# Altium schematic sheet MKRZero_V5.0_1.SchDoc: MKRZero_V5.0
size 409 x 289 mm; Origin: Eagle; Date: 2023-03-06 22:57:54; SheetNumber: 2; CODE-ARDUINO: DNP; DATASHEET: DNP; DISTRIBUTOR-LINK: DNP; DISTRIBUTOR-PN: DNP; MANUFACTURER: DNP; MANUFACTURER-PN: DNP; NOTE: DNP; Value: DNP; GateName_1: G$1; SymbolName_1: A3L-LOC; LibraryName: Arduino-utility; DeviceSetName: A3-FRAME; Sheet: Sheet:; ReferenceDesignsAREPROVIDED"ASIS"AND"WITHALLFAULTS.ArduinoSADISCLAIMSALLOTHERWARRANTIES,EXPRESSORIMPLIED,
REGARDINGPRODUCTS,INCLUDINGBUTNOTLIMITEDTO,ANYIMPLIEDWARRANTIESOFMERCHANTABILITYORFITNESSFORAPARTICULARPURPOSE

ArduinoSAmaymakechangestospecificationsandproductdescriptionsatanytime,withoutnotice.TheCustomermustnot
relyontheabsenceorcharacteristicsofanyfeaturesorinstructionsmarked"reserved"or"undefined."ArduinoSAreserves
theseforfuturedefinitionandshallhavenoresponsibilitywhatsoeverforconflictsorincompatibilitiesarisingfromfuturechangestothem.
TheproductinformationontheWebSiteorMaterialsissubjecttochangewithoutnotice.Donotfinalizeadesignwiththisinfo

ARDUINOandotherArduinobrandsandlogosandTrademarksofArduinoSA.AllArduinoSATrademarkscannotbeusedwithoutowner'sformalpermission: Reference Designs ARE PROVIDED "AS IS" AND "WITH ALL FAULTS. Arduino SA DISCLAIMS ALL OTHER WARRANTIES, EXPRESS OR IMPLIED, / REGARDING PRODUCTS, INCLUDING BUT NOT LIMITED TO, ANY IMPLIED WARRANTIES OF MERCHANTABILITY OR FITNESS FOR A PARTICULAR PURPOSE / Arduino SA may make changes to specifications and product descriptions at any time, without notice. The Customer must not / rely on the absence or characteristics of any features or instructions marked "reserved" or "undefined." Arduino SA reserves / these for future definition and shall have no responsibility whatsoever for conflicts or incompatibilities arising from future changes to them. / The product information on the Web Site or Materials is subject to change without notice. Do not finalize a design with this info / ARDUINO and other Arduino brands and logos and Trademarks of Arduino SA. All Arduino SA Trademarks cannot be used without owner's formal permission
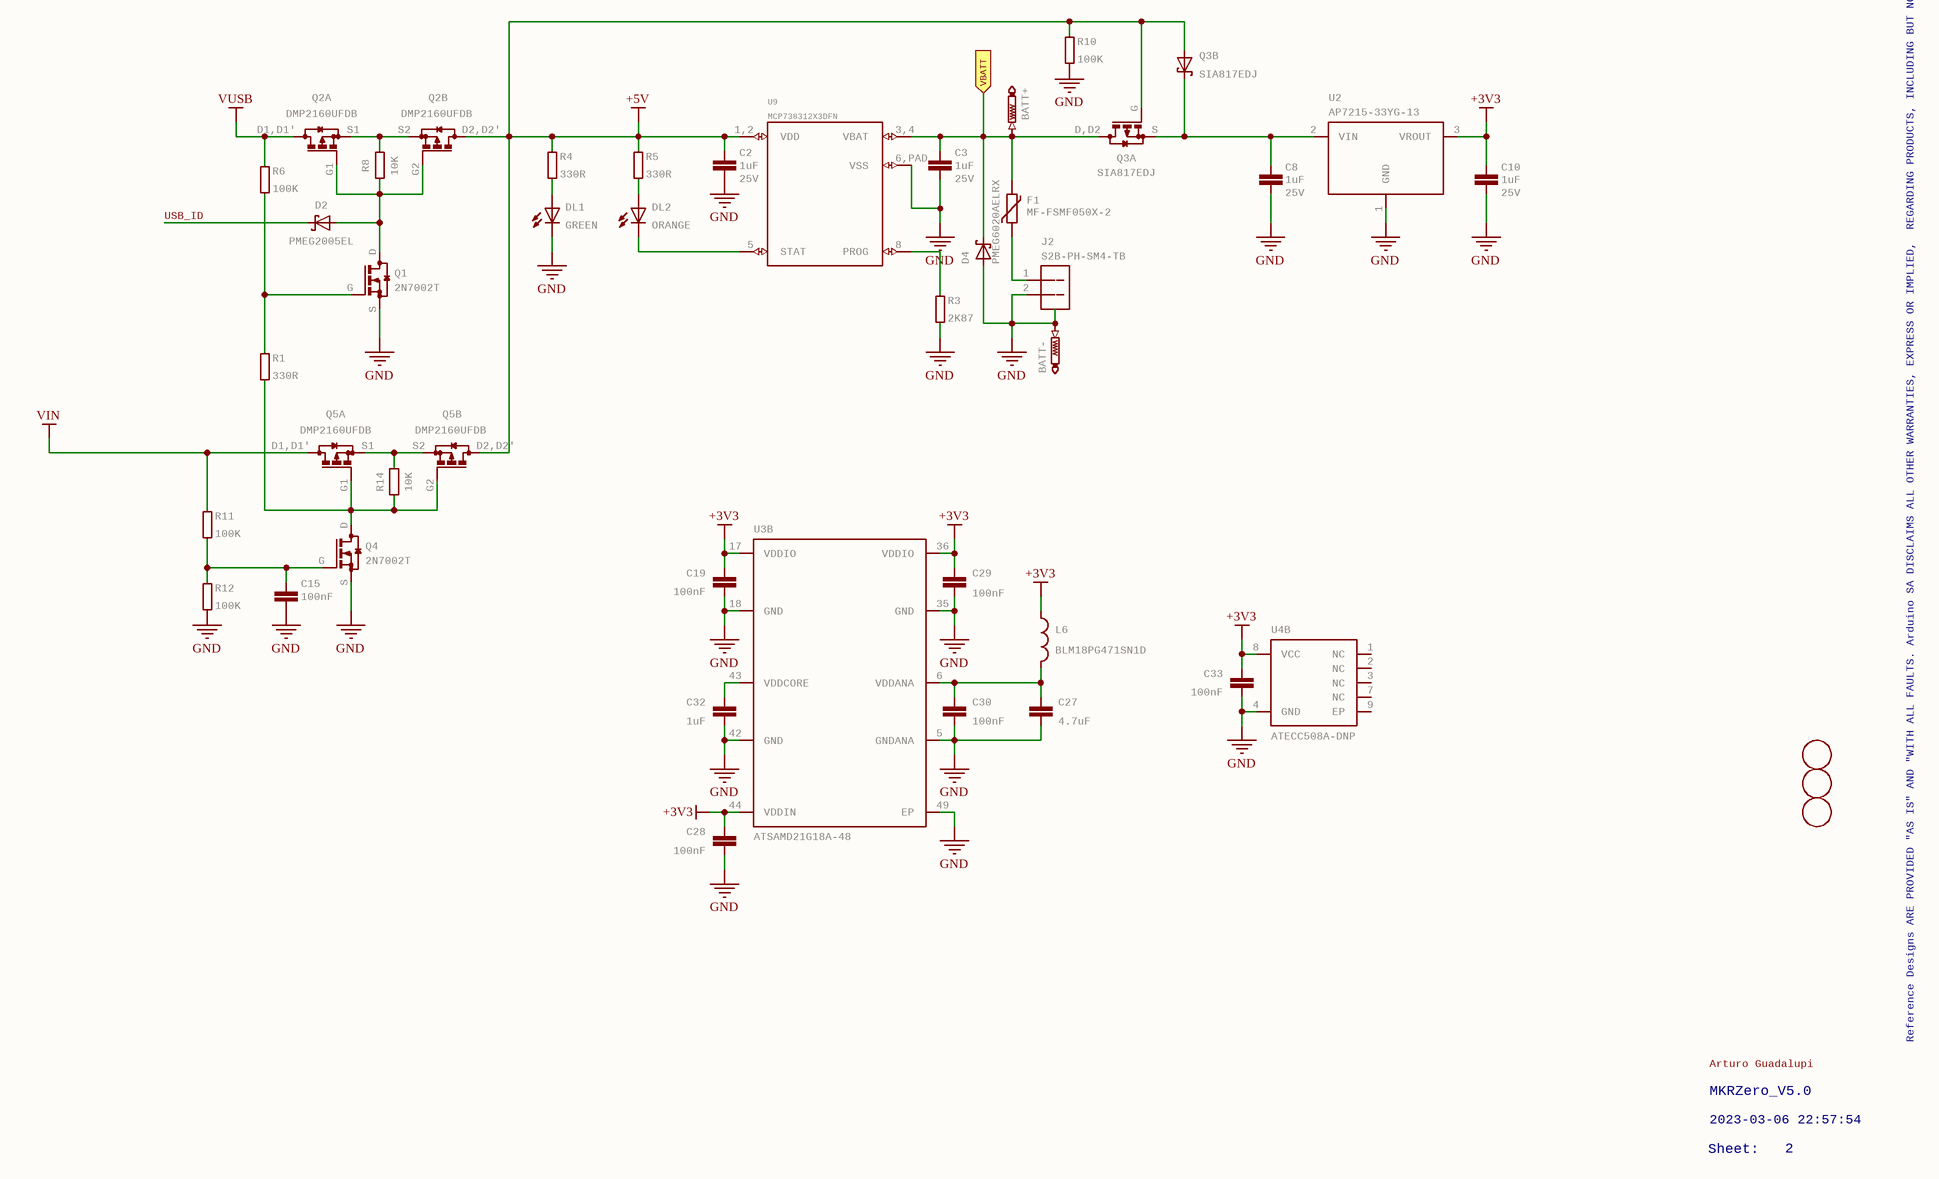
[diagram p0: MKRZero_V5.0_1.SchDoc]

## Parts
BATT+  PTR1B1,27  [B1,27]  (value not drawn)
BATT-  PTR1B1,27  [B1,27]  (value not drawn)
C2  1uF  VOLTAGE: 25V  [0402-1005X55N]
C3  1uF  VOLTAGE: 25V  [0402-1005X55N]
C8  1uF  VOLTAGE: 25V  [0402-1005X55N]
C10  1uF  VOLTAGE: 25V  [0402-1005X55N]
C15  100nF  [0402-1005X55N]
C19  100nF  [0402-1005X55N]
C27  4.7uF  [0402-1005X55N]
C28  100nF  [0402-1005X55N]
C29  100nF  [0402-1005X55N]
C30  100nF  [0402-1005X55N]
C32  1uF  [0402-1005X55N]
C33  100nF  [0402-1005X55N]
D2  PMEG2005EL  [SODFL1008X40N-882D]
D4  PMEG6020AELRX  [SMA_DO123]
DL1  GREEN  [LEDC1608X80N-AK]
DL2  ORANGE  [LEDC1608X80N-AK]
F1  MF-FSMF050X-2  [0603-F1608X100N]
FD1  FIDUCIALMOUNT  [FIDUCIAL-MOUNT]  (value not drawn)
FD2  FIDUCIALMOUNT  [FIDUCIAL-MOUNT]  (value not drawn)
FD3  FIDUCIALMOUNT  [FIDUCIAL-MOUNT]  (value not drawn)
J2  S2B-PH-SM4-TB  [JST-S2B-PH-SM4-TB]
L6  BLM18PG471SN1D  [0603-1608X90N]
Q1  2N7002T  [SOTFL50P160X78-3]
Q2  DMP2160UFDB  [SON65P200X200X60-8N-DM]  (parts A,B of 2)
Q3  SIA817EDJ  [SON65P205X205X75-8N-MWSD]  (parts A,B of 2)
Q4  2N7002T  [SOTFL50P160X78-3]
Q5  DMP2160UFDB  [SON65P200X200X60-8N-DM]  (parts A,B of 2)
R1  330R  [0402-1005X55N]
R3  2K87  [0402-1005X55N]
R4  330R  [0402-1005X55N]
R5  330R  [0402-1005X55N]
R6  100K  [0402-1005X55N]
R8  10K  [0402-1005X55N]
R10  100K  [0402-1005X55N]
R11  100K  [0402-1005X55N]
R12  100K  [0402-1005X55N]
R14  10K  [0402-1005X55N]
U2  AP7215-33YG-13  [SOT150P400X160-3N]
U3  ATSAMD21G18A-48  [QFN50P700X700X90-49XN-EPSQ515]  (part B of 2)
U4  ATECC508A-DNP  [SON50P300X200X60-9N-EP160X140]  (part B of 2)
U9  MCP738312X3DFN  [2X3DFN]

## Ports
VBATT (in)

## Nets
+3V3: C10.1 C19.1 C28.1 C29.1 C33.1 L6.1 U2.3(VROUT) U3.17(VDDIO) U3.36(VDDIO) U3.44(VDDIN) U4.8(VCC)
+5V: C2.1 Q2.D2,D2'(D) Q3.A Q3.G Q5.D2,D2'(D) R4.2 R5.2 R10.2 U9.1,2(VDD)
GND: BATT-.PP(TP) C2.2 C3.2 C8.2 C10.2 C15.2 C19.2 C27.2 C28.2 C29.2 C30.2 C32.2 C33.2 D4.A DL1.C J2.2 J2.3,4(SH) Q1.S Q4.S R3.1 R10.1 R12.1 U2.1(GND) U3.5(GNDANA) U3.18(GND) U3.35(GND) U3.42(GND) U3.49(EP) U4.4(GND) U9.6,PAD(VSS)
VIN: Q5.D1,D1'(D) R11.2
VUSB: Q2.D1,D1'(D) R6.2
USB_ID: D2.C
VBATT: BATT+.PP(TP) C3.1 D4.C F1.2 Q3.D,D2(D) U9.3,4(VBAT) ; port VBATT
NetC8_1: C8.1 Q3.K,K2(C) Q3.S U2.2(VIN)
NetC15_1: C15.1 Q4.G R11.1 R12.2
NetC27_1: C27.1 C30.1 L6.2 U3.6(VDDANA)
NetC32_1: C32.1 U3.43(VDDCORE)
NetD2_A: D2.A Q1.D Q2.G1(G) Q2.G2(G) R8.1
NetDL1_A: DL1.A R4.1
NetDL2_A: DL2.A R5.1
NetDL2_C: DL2.C U9.5(STAT)
NetF1_1: F1.1 J2.1
NetQ1_G: Q1.G R1.2 R6.1
NetQ2_S1: Q2.S1(S) Q2.S2(S) R8.2
NetQ4_D: Q4.D Q5.G1(G) Q5.G2(G) R1.1 R14.1
NetQ5_S1: Q5.S1(S) Q5.S2(S) R14.2
NetR3_2: R3.2 U9.8(PROG)

Not connected (* = marked no-connect by the designer): U4 1(NC) 2(NC) 3(NC) 7(NC) 9(EP)

## Notes on the sheet
- Reference Designs ARE PROVIDED "AS IS" AND "WITH ALL FAULTS. Arduino SA DISCLAIMS ALL OTHER WARRANTIES, EXPRESS OR IMPLIED,
  REGARDING PRODUCTS, INCLUDING BUT NOT LIMITED TO, ANY IMPLIED WARRANTIES OF MERCHANTABILITY OR FITNESS FOR A PARTICULAR PURPOSE
  Arduino SA may make changes to specifications and product descriptions at any time, without notice. The Customer must not
  rely on the absence or characteristics of any features or instructions marked "reserved" or "undefined." Arduino SA reserves
  these for future definition and shall have no responsibility whatsoever for conflicts or incompatibilities arising from future changes to them.
  The product information on the Web Site or Materials is subject to change without notice. Do not finalize a design with this info
  ARDUINO and other Arduino brands and logos and Trademarks of Arduino SA. All Arduino SA Trademarks cannot be used without owner's formal permission
- Arturo Guadalupi
- MKRZero_V5.0
- Sheet:
- 2023-03-06 22:57:54
- 2

## Library data of the parts
BATT+ BATT- = PTR1B1,27: TEST PIN; GateName_1: G$1; SymbolName_1: PS; DeviceSetName: PTR1; DeviceName: B1,27; LibraryName: testpad
C2 C3 C8 C10 C32 = C-0402: Capacitor; MPN: GRM155R61E105KA12D; GateName_1: G$1; SymbolName_1: C; DeviceName: -0402; DESCR: CAP CER 1UF 25V 10% X5R 0402; MF: Murata; LibraryName: MK1_Zero; DeviceSetName: C
C15 = C-0402: Capacitor; MPN: GRM155R61E105KA12D; GateName_1: G$1; SymbolName_1: C; DeviceName: -0402; DESCR: CAP CER 1UF 25V 10% X5R 0402; MF: Murata; VOLTAGE: 25V; LibraryName: MK1_Zero; DeviceSetName: C
C19 C28-C30 C33 = C-0402: Capacitor; MPN: C1005X5R1H104K050BB; GateName_1: G$1; SymbolName_1: C; DeviceName: -0402; DESCR: CAP CER 0.1UF 50V 10% X5R 0402; MF: TDK; LibraryName: MK1_Zero; DeviceSetName: C
C27 = C-0402: Capacitor; MPN: GRM155R60J475ME47D; GateName_1: G$1; SymbolName_1: C; DeviceName: -0402; DESCR: CAP CER 4.7UF 6.3V 20% X5R 0402; MF: Murata; LibraryName: MK1_Zero; DeviceSetName: C
D2 = PMEG2005EL: DIODE SCHOTTKY 20V 500MA SOD882; MPN: PMEG2005EL,315; GateName_1: G$1; MF: NXP; SymbolName_1: SCHOTTKY; LibraryName: MK1_Zero; DeviceSetName: PMEG2005EL; DESCR: DIODE SCHOTTKY 20V 500MA SOD882
D4 = D_SCHOTTKYSO123: Schottky Diodes; GateName_1: D; DeviceName: SO123; SymbolName_1: SCHOTTKY; LibraryName: Arduino-diodes; DeviceSetName: D_SCHOTTKY
DL1 = LED-0603: LED; MPN: HSMG-C190; GateName_1: G$1; DeviceName: -0603; DESCR: LED GREEN DIFFUSED 0603 SMD; MF: Avago; SymbolName_1: LED; LibraryName: MK1_Zero; DeviceSetName: LED
DL2 = LED-0603: LED; MPN: HSMD-C190; GateName_1: G$1; DeviceName: -0603; DESCR: LED ORANGE DIFFUSED 0603 SMD; MF: Avago; SymbolName_1: LED; LibraryName: MK1_Zero; DeviceSetName: LED
F1 = MF-FSMF050X-2: FUSE PTC RESET 500MA SMD 0603; GateName_1: G$1; MF: Bourns Inc; SymbolName_1: PTC; LibraryName: MK1_Zero; DeviceSetName: MF-FSMF050X-2; DESCR: FUSE PTC RESET 500MA SMD 0603; MPN: MF-FSMF050X-2
FD1-FD3 = FIDUCIALMOUNT: GateName_1: G$1; SymbolName_1: FIDUCIAL; LibraryName: Arduino-utility; DeviceSetName: FIDUCIALMOUNT
J2 = S2B-PH-SM4-TB: CONN HEADER PH SIDE 2POS 2MM SMD; MPN: S2B-PH-SM4-TB(LF)(SN); GateName_1: G$1; SymbolName_1: M02; MF: JST; LibraryName: MK1_Zero; DeviceSetName: S2B-PH-SM4-TB; DESCR: CONN HEADER PH SIDE 2POS 2MM SMD
L6 = BLM18PG471SN1D: FERRITE CHIP 470 OHM 1000MA 0603; GateName_1: G$1; SymbolName_1: L; LibraryName: MK1_Zero; DeviceSetName: BLM18PG471SN1D
Q1 Q4 = 2N7002T: MOSFET N-CH 60V 115MA SOT-523F; GateName_1: G$1; SymbolName_1: N-MOS; MF: Fairchild; LibraryName: MK1_Zero; DeviceSetName: 2N7002T; DESCR: MOSFET N-CH 60V 115MA SOT-523F; MPN: 2N7002T
Q2 Q5 = DMP2160UFDB: MOSFET 2P-CH 20V 3.8A 6UDFN; MPN: DMP2160UFDB-7; GateName_1: A; SymbolName_1: P-MOS; GateName_2: B; MF: Diodes Inc; SymbolName_2: P-MOS; LibraryName: MK1_Zero; DeviceSetName: DMP2160UFDB; DESCR: MOSFET 2P-CH 20V 3.8A 6UDFN
Q3 = SIA817EDJ: MOSFET P-CH 30V 4.5A SC-70-6; MPN: SIA817EDJ-T1-GE3; GateName_1: A; SymbolName_1: P-MOS; GateName_2: B; SymbolName_2: SCHOTTKY; MF: Vishay; LibraryName: MK1_Zero; DeviceSetName: SIA817EDJ; DESCR: MOSFET P-CH 30V 4.5A SC-70-6
R1 R4 R5 = R-0402: Resistor; MPN: RC0402FR-07330RL; GateName_1: G$1; SymbolName_1: R; DeviceName: -0402; DESCR: RES 330 OHM 1/16W 1% 0402 SMD; MF: Yageo; LibraryName: MK1_Zero; DeviceSetName: R
R3 = R-0402: Resistor; MPN: RC0402FR-072K87L; GateName_1: G$1; SymbolName_1: R; DeviceName: -0402; DESCR: RES SMD 2.87K OHM 1% 1/16W 0402; MF: Yageo; LibraryName: MK1_Zero; DeviceSetName: R
R6 R10-R12 = R-0402: Resistor; MPN: RC0402FR-07100KL; GateName_1: G$1; SymbolName_1: R; DeviceName: -0402; DESCR: RES 100K OHM 1/16W 1% 0402 SMD; MF: Yageo; LibraryName: MK1_Zero; DeviceSetName: R
R8 R14 = R-0402: Resistor; MPN: RC0402FR-0710KL; GateName_1: G$1; SymbolName_1: R; DeviceName: -0402; DESCR: RES SMD 10K OHM 1% 1/16W 0402; MF: Yageo; LibraryName: MK1_Zero; DeviceSetName: R
U2 = AP7215-33YG-13: IC REG LDO 3.3V 0.6A SOT89-3   Datasheet; GateName_1: G$1; MF: Diodes Inc; SymbolName_1: AP7215-33YG-13; LibraryName: MK1_Zero; DeviceSetName: AP7215-33YG-13; DESCR: IC REG LDO 3.3V 0.6A SOT89-3; MPN: AP7215-33YG-13
U3 = ATSAMD21G18A-48: IC MCU 32BIT 256KB FLASH 48QFN   Datasheet (Summary) Datasheet (Complete); MPN: ATSAMD21E18A-MU; GateName_1: A; SymbolName_1: ATSAMD21G18A-48-A; GateName_2: B; SymbolName_2: ATSAMD21G18A-48-B; MF: Atmel; LibraryName: MK1_Zero; DeviceSetName: ATSAMD21G18A-48; DESCR: IC MCU 32BIT 256KB FLASH 48QFN
U4 = ATECC508A-MAHDA-T: IC CRYPTO ECC 8KB 8-UDFN I2C; GateName_1: A; SymbolName_1: ATECC508A-A; GateName_2: B; SymbolName_2: ATECC508A-B; MF: Atmel; LibraryName: MK1_Zero; DeviceSetName: ATECC508A-MAHDA-T; DESCR: IC CRYPTO ECC 8KB 8-UDFN I2C; MPN: ATECC508A-MAHDA-T
U9 = MCP738312X3DFN: GateName_1: G$1; SymbolName_1: MCP73831; DeviceName: 2X3DFN; LibraryName: Arduino-ICs; DeviceSetName: MCP73831